# Altium schematic sheet TOP.SchDoc
size A4; SheetNumber: 1; SheetTotal: 1
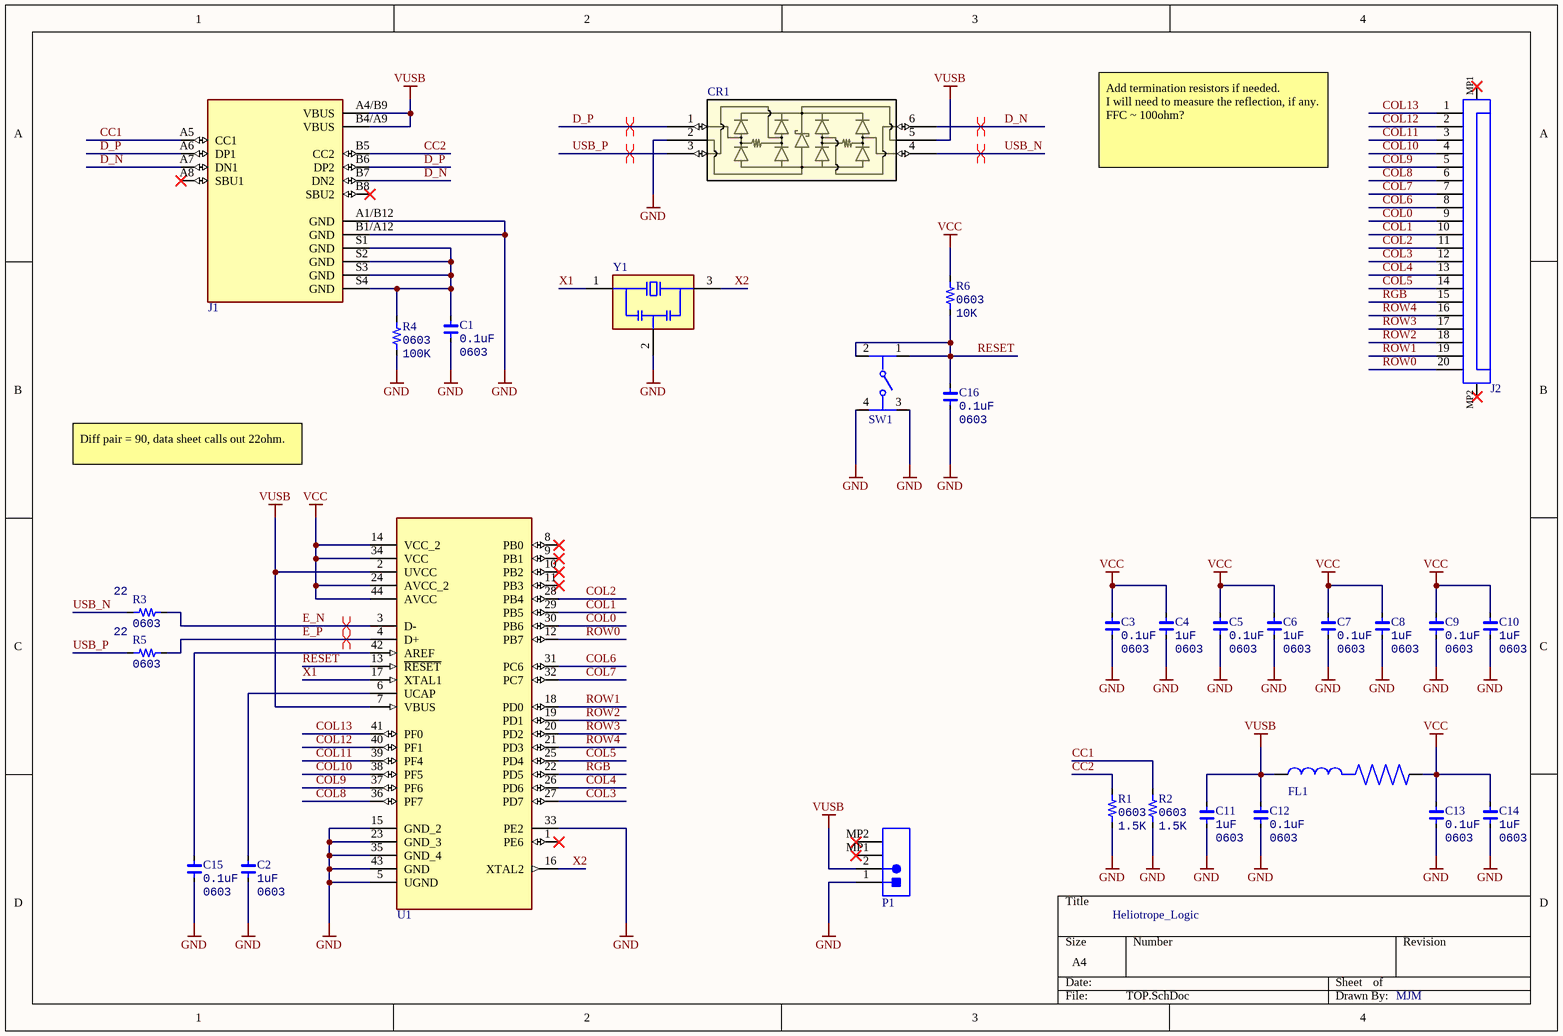
[diagram p0: TOP.SchDoc]

## Parts
C1  value 0.1uF  Type: 0603  [FP-CC0603-DA-MFG]  (hidden comment: CC0603JRX7R9BB104)
C2  value 1uF  Type: 0603  [FP-CC0603-DA-MFG]  (hidden comment: CC0603JRX7R7BB105)
C3  value 0.1uF  Type: 0603  [FP-CC0603-DA-MFG]  (hidden comment: CC0603JRX7R9BB104)
C4  value 1uF  Type: 0603  [FP-CC0603-DA-MFG]  (hidden comment: CC0603JRX7R7BB105)
C5  value 0.1uF  Type: 0603  [FP-CC0603-DA-MFG]  (hidden comment: CC0603JRX7R9BB104)
C6  value 1uF  Type: 0603  [FP-CC0603-DA-MFG]  (hidden comment: CC0603JRX7R7BB105)
C7  value 0.1uF  Type: 0603  [FP-CC0603-DA-MFG]  (hidden comment: CC0603JRX7R9BB104)
C8  value 1uF  Type: 0603  [FP-CC0603-DA-MFG]  (hidden comment: CC0603JRX7R7BB105)
C9  value 0.1uF  Type: 0603  [FP-CC0603-DA-MFG]  (hidden comment: CC0603JRX7R9BB104)
C10  value 1uF  Type: 0603  [FP-CC0603-DA-MFG]  (hidden comment: CC0603JRX7R7BB105)
C11  value 1uF  Type: 0603  [FP-CC0603-DA-MFG]  (hidden comment: CC0603JRX7R7BB105)
C12  value 0.1uF  Type: 0603  [FP-CC0603-DA-MFG]  (hidden comment: CC0603JRX7R9BB104)
C13  value 0.1uF  Type: 0603  [FP-CC0603-DA-MFG]  (hidden comment: CC0603JRX7R9BB104)
C14  value 1uF  Type: 0603  [FP-CC0603-DA-MFG]  (hidden comment: CC0603JRX7R7BB105)
C15  value 0.1uF  Type: 0603  [FP-CC0603-DA-MFG]  (hidden comment: CC0603JRX7R9BB104)
C16  value 0.1uF  Type: 0603  [FP-CC0603-DA-MFG]  (hidden comment: CC0603JRX7R9BB104)
CR1  IP4234CZ6,125  [TSOP6_SOT457_NEX]  (value not drawn)
FL1  BLM18AG601SN1D  [BEADC1608X95N]  (value not drawn)
J1  USB4110-GF-A  [GCT_USB4110-GF-A_REVB]  (value not drawn)
J2  68712014522  [68712014522]  (value not drawn)
P1  53261-0271  [MOLX-53261-0271_V]  (value not drawn)
R1  value 1.5K  Type: 0603  [FP-RMCF0603-MFG]  (hidden comment: RMCF0603JT5K10)
R2  value 1.5K  Type: 0603  [FP-RMCF0603-MFG]  (hidden comment: RMCF0603JT5K10)
R3  value 22  Type: 0603  [FP-RMCF0603-MFG]  (hidden comment: RMCF0603JT22R0)
R4  value 100K  Type: 0603  [FP-RMCF0603-MFG]  (hidden comment: RMCF0603JT100K)
R5  value 22  Type: 0603  [FP-RMCF0603-MFG]  (hidden comment: RMCF0603JT22R0)
R6  value 10K  Type: 0603  [FP-RMCF0603-MFG]  (hidden comment: RMCF0603JT10K0)
SW1  PTS526SK15SMTR2LFS  [FP-PTS526SK15SMTR2LFS-MFG]  (value not drawn)
U1  ATMEGA32U4-AU  [QFP80P1200X1200X120-44N]  (value not drawn)
Y1  CSTNE16M0V51Z000R0  [OSC_CSTNE16M0V51Z000R0]  (value not drawn)

## Nets
GND: C1.1 C2.1 C3.1 C4.1 C5.1 C6.1 C7.1 C8.1 C9.1 C10.1 C11.1 C12.1 C13.1 C14.1 C15.1 C16.1 CR1.2(GROUND) J1.A1/B12(GND) J1.B1/A12(GND) P1.1 R1.1 R2.1 R4.1 SW1.3 SW1.4 U1.5(UGND) U1.15(GND_2) U1.23(GND_3) U1.33(PE2) U1.35(GND_4) U1.43(GND) Y1.2(GND)
VCC: C3.2 C4.2 C5.2 C6.2 C7.2 C8.2 C9.2 C10.2 C13.2 C14.2 FL1.2 R6.2 U1.14(VCC_2) U1.24(AVCC_2) U1.34(VCC) U1.44(AVCC)
VUSB: C11.2 C12.2 CR1.5(SUPPLY_VOLTAGE) FL1.1 J1.A4/B9(VBUS) J1.B4/A9(VBUS) P1.2 U1.2(UVCC) U1.7(VBUS)
CC1: J1.A5(CC1) R2.2
CC2: J1.B5(CC2) R1.2
COL0: J2.9 U1.30(PB6)
COL1: J2.10 U1.29(PB5)
COL2: J2.11 U1.28(PB4)
COL3: J2.12 U1.27(PD7)
COL4: J2.13 U1.26(PD6)
COL5: J2.14 U1.25(PD4)
COL6: J2.8 U1.31(PC6)
COL7: J2.7 U1.32(PC7)
COL8: J2.6 U1.36(PF7)
COL9: J2.5 U1.37(PF6)
COL10: J2.4 U1.38(PF5)
COL11: J2.3 U1.39(PF4)
COL12: J2.2 U1.40(PF1)
COL13: J2.1 U1.41(PF0)
D_N: CR1.6(ESD_PROTECTION_I/O_CHANNEL_2) J1.A7(DN1) J1.B7(DN2)
D_P: CR1.1(ESD_PROTECTION_I/O_CHANNEL_1) J1.A6(DP1) J1.B6(DP2)
E_N: R3.2 U1.3(D-)
E_P: R5.2 U1.4(D+)
RESET: C16.2 R6.1 SW1.1 SW1.2 U1.13(~{RESET})
RGB: J2.15 U1.22(PD5)
ROW0: J2.20 U1.12(PB7)
ROW1: J2.19 U1.18(PD0)
ROW2: J2.18 U1.19(PD1)
ROW3: J2.17 U1.20(PD2)
ROW4: J2.16 U1.21(PD3)
USB_N: CR1.4(ESD_PROTECTION_I/O_CHANNEL_2) R3.1
USB_P: CR1.3(ESD_PROTECTION_I/O_CHANNEL_1) R5.1
X1: U1.17(XTAL1) Y1.1(IN)
X2: U1.16(XTAL2) Y1.3(OUT)
NetC1_2: C1.2 J1.S1(GND) J1.S2(GND) J1.S3(GND) J1.S4(GND) R4.2
NetC2_2: C2.2 U1.6(UCAP)
NetC15_2: C15.2 U1.42(AREF)

Not connected (* = marked no-connect by the designer): J1 A8(SBU1)* B8(SBU2)*; J2 MP1* MP2*; P1 MP1* MP2*; U1 1(PE6)* 8(PB0)* 9(PB1)* 10(PB2)* 11(PB3)*

## Layout directives
differential pair: D_N, D_P, E_N, E_P, USB_N, USB_P

## Notes on the sheet
- Add termination resistors if needed.
  I will need to measure the reflection, if any.
  FFC ~ 100ohm?
- Diff pair = 90, data sheet calls out 22ohm.
- Heliotrope_Logic
- MJM

## Library data of the parts
C1 C3 C5 C7 C9 C12 C13 C15 C16 = CMP-004-000009-6: 0603 0.1 uF 50 V ±5 % Tolerance X7R SMT Multilayer Ceramic Capacitor
C2 C4 C6 C8 C10 C11 C14 = CMP-004-000010-4: Cap Ceramic 1uF 16V X7R 5% SMD 0603 125°C Paper T/R
CR1 = CMP-028-000000-3: TVS DIODE 5.5VWM 6TSOP; Mfr_Name: Nexperia; Component Type: Standard; Digi-Key_Part_Number_1: 1727-4717-2-ND; Pin Count: 6; Manufacturer_Part_Number: IP4234CZ6,125; Digi-Key_Part_Number_2: 1727-4717-1-ND; Design Item ID: IP4234CZ6,125; Source: IP4234CZ6,125.SchLib; Digi-Key_Part_Number_3: 1727-4717-6-ND
FL1 = CMP-032-000000-2: 600 Ohms @ 100MHz 1 Ferrite Bead 0603 _1608 Metric_ 500mA 380mOhm; Manufacturer: Murata; value: 600 Ohm; Design Item ID: BLM18AG601SN1D; Digi-Key_Part_Number: 490-1014-1-ND; Component Type: Standard; Package: 0608; Manufacturer Product Number: BLM18AG601SN1D; Pin Count: 2; Source: SnapEDAsch.SchLib
J1 = CMP-130-000000-7: Conn USB Type C RCP 16 POS 0.3mm/0.5mm Solder ST SMD 16 Terminal 1 Port T/R; MP: USB4110-GF-A; Component Type: Standard; Source: USB4110-GF-A_REVB.SchLib; Package: None; Pin Count: 16; Price: None; Value: *; Design Item ID: USB4110-GF-A; Availability: Unavailable
J2 = CMP-00003-2: Ffc / Fpc Board Connector, Zif, Surface Mount, Plug, 20, Bottom, 0.5 Mm Rohs Compliant: Yes; MF: Wurth Electronics; SnapEDA_Link: https://www.snapeda.com/parts/68712014522/Wurth+Electronics+Inc./view-part/?ref=snap; Design Item ID: 68712014522; Purchase-URL: https://pricing.snapeda.com/search/part/68712014522/?ref=eda; Pin Count: 20; Package: None; Value: *; Availability: In Stock; MP: 68712014522; Component Type: Standard; Price: None; Source: 68712014522.SchLib; Check_prices: https://www.snapeda.com/parts/68712014522/Wurth+Electronics+Inc./view-part/?ref=eda
P1 = CMP-042-000002-1: 1.25mm Pitch PicoBlade™ Header, Surface Mount, Right Angle, Lead-Free, 2 Circuits
R1 R2 = CMP-012-000000-1: Res Thick Film 0603 5.1K Ohm 5% 1/10W ±200ppm/°C Molded SMD Paper T/R
R3 R5 = CMP-000003-8: Res Thick Film 0603 22 Ohm 5% 1/10W ±200ppm/°C Molded SMD Paper T/R
R4 = CMP-000004-8: Res Thick Film 0603 100K Ohm 5% 1/10W ±200ppm/°C Molded SMD Paper T/R
R6 = CMP-012-000009-4: Res Thick Film 0603 10K Ohm 5% 1/10W ±100ppm/°C Molded SMD SMD Paper T/R
SW1 = CMP-094-000003-1: Switch Tactile N.O. SPST Round Button Gull Wing 0.05A 12VDC 200000Cycles 2.55N SMD T/R
U1 = CMP-124-000000-5: IC MCU 8BIT 32KB FLASH 44TQFP; MF: Microchip Technology / Atmel; Package: None; Availability: Unavailable; Component Type: Standard; Value: *; Design Item ID: ATMEGA32U4-AU; MP: ATMEGA32U4-AU; Source: SnapEDAsch.SchLib; SnapEDA_Link: https://www.snapeda.com/parts/ATMEGA32U4-16AU/Atmel/view-part/4705464/?ref=snap; Price: None; Pin Count: 44
Y1 = CMP-128-000000-2: Ceramic Resonator 16MHz 5pF 3-Pin Surface Mount Emboss T/R; MF: Murata Electronics; Component Type: Standard; Pin Count: 3; Design Item ID: CSTNE16M0V51Z000R0; Value: *; Package: SMD-3 Murata; Source: CSTNE16M0V51Z000R0.SchLib; MP: CSTNE16M0V51Z000R0; SnapEDA_Link: https://www.snapeda.com/parts/CSTNE16M0V51Z000R0/Murata/view-part/4705154/?ref=snap; Price: None; Check_prices: https://www.snapeda.com/parts/CSTNE16M0V51Z000R0/Murata/view-part/4705154/?ref=eda